# EAGLE design ESP_SIM7000V2.62 (EAGLE 9.6.2)

## Sheet 1 of 2
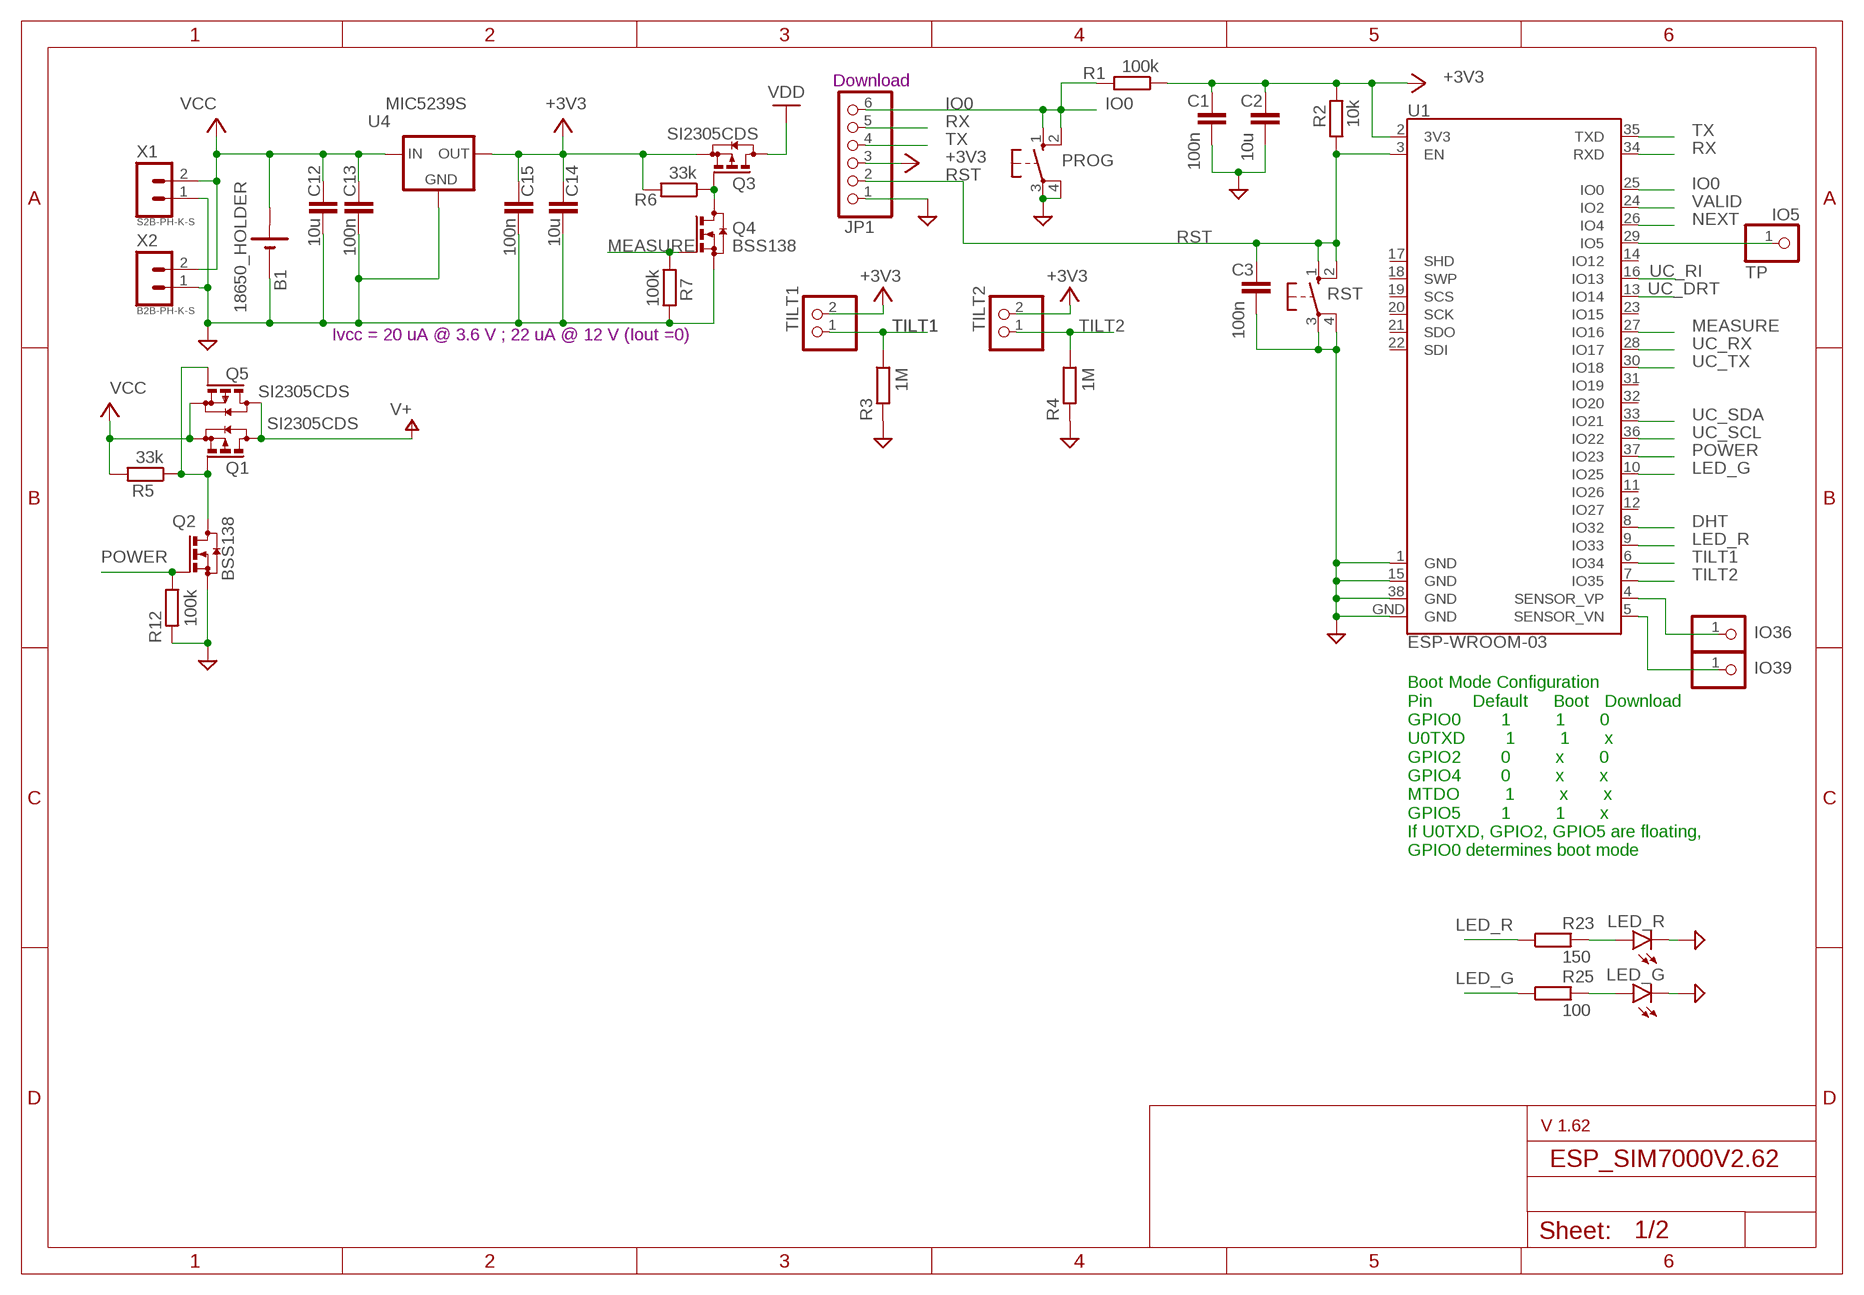
[diagram p0: schematic, sheet 1]

### Parts
B1  18650_HOLDER  [18650]
C1  100n  CC1206  [C1206]
C2  10u  CC1210  [C1210]
C3  100n  CC1206  [C1206]
C12  10u  CC1210  [C1210]
C13  100n  CC1206  [C1206]
C14  10u  CC1210  [C1210]
C15  100n  CC1206  [C1206]
IO5  TP  PINHD-1X1  [1X01]
IO36  PINHD-1X1  [1X01]
IO39  PINHD-1X1  [1X01]
JP1  PINHD-1X6  [1X06]
LED_G  LEDSMT1206  [1206]
LED_R  LEDSMT1206  [1206]
PROG  10-XX  [B3F-10XX]
Q1  SI2305CDS  [SOT23]
Q2  BSS138  BSS131  [SOT23]
Q3  SI2305CDS  [SOT23]
Q4  BSS138  BSS131  [SOT23]
Q5  SI2305CDS  [SOT23]
R1  100k  RR1206  [R1206]
R2  10k  RR1206  [R1206]
R3  1M  RR1206  [R1206]
R4  1M  RR1206  [R1206]
R5  33k  RR1206  [R1206]
R6  33k  RR1206  [R1206]
R7  100k  RR1206  [R1206]
R12  100k  RR1206  [R1206]
R23  150  RR1206  [R1206]
R25  100  RR1206  [R1206]
RST  10-XX  [B3F-10XX]
TILT1  PINHD-1X2  [1X02]
TILT2  PINHD-1X2  [1X02]
U1  ESP-WROOM-03  [ESP-WROOM-03]
U4  MIC5239S  [SOT223]
X1  S2B-PH-K-S  [S2B-PH-K-S]
X2  B2B-PH-K-S  [B2B-PH-K-S]

### Nets
+3V3: C1.1 C2.1 C14.1 C15.1 JP1.3 Q3.2(S) R1.1 R2.2 R6.2 TILT1.2 TILT2.2 U1.2(3V3) U4.3(OUT)
DHT: U1.8(IO32)
GND: B1.- C1.2 C2.2 C3.2 C12.2 C13.2 C14.2 C15.2 JP1.1 LED_G.C LED_R.C PROG.3(P) PROG.4(P1) Q2.2(S) Q4.2(S) R3.2 R4.2 R7.2 R12.2 RST.3(P) RST.4(P1) U1.1(GND) U1.15(GND) U1.38(GND) U1.GND U4.2(GND) U4.4(GND) X1.1 X2.1 ; also sheet 2
IO0: JP1.6 PROG.1(S) PROG.2(S1) R1.2 U1.25(IO0)
IO36: IO36.1 U1.4(SENSOR_VP)
IO39: IO39.1 U1.5(SENSOR_VN)
LED_G: R25.1 U1.10(IO25)
LED_R: R23.1 U1.9(IO33) ; also sheet 2
MEASURE: Q4.1(G) R7.1 U1.27(IO16)
N$1: Q1.1(G) Q2.3(D) Q5.1(G) R5.1
N$2: Q3.1(G) Q4.3(D) R6.1
N$7: LED_R.A R23.2
N$8: LED_G.A R25.2
N$17: IO5.1 U1.29(IO5)
NEXT: U1.26(IO4)
POWER: Q2.1(G) R12.1 U1.37(IO23)
RST: C3.1 JP1.2 R2.1 RST.1(S) RST.2(S1) U1.3(EN)
RX: JP1.5 U1.34(RXD)
TILT1: R3.1 TILT1.1 U1.6(IO34)
TILT2: R4.1 TILT2.1 U1.7(IO35)
TX: JP1.4 U1.35(TXD)
UC_DRT: U1.13(IO14) ; also sheet 2
UC_RI: U1.16(IO13) ; also sheet 2
UC_RX: U1.28(IO17) ; also sheet 2
UC_SCL: U1.36(IO22) ; also sheet 2
UC_SDA: U1.33(IO21) ; also sheet 2
UC_TX: U1.30(IO18) ; also sheet 2
V+: Q1.3(D) Q5.3(D)
VALID: U1.24(IO2)
VCC: B1.+ C12.1 C13.1 Q1.2(S) Q5.2(S) R5.2 U4.1(IN) X1.2 X2.2
VDD: Q3.3(D)
Unconnected: U1.11(IO26) U1.12(IO27) U1.14(IO12) U1.17(SHD) U1.18(SWP) U1.19(SCS) U1.20(SCK) U1.21(SDO) U1.22(SDI) U1.23(IO15) U1.31(IO19) U1.32(IO20)

### Notes on the sheet
- Download
- Ivcc = 20 uA @ 3.6 V ; 22 uA @ 12 V (Iout =0)
- Boot Mode Configuration
  Pin        Default     Boot   Download
  GPIO0        1         1       0
  U0TXD        1         1       x
  GPIO2        0         x       0
  GPIO4        0         x       x
  MTDO         1         x       x
  GPIO5        1         1       x
  If U0TXD, GPIO2, GPIO5 are floating, 
  GPIO0 determines boot mode
- V 1.62

## Sheet 2 of 2
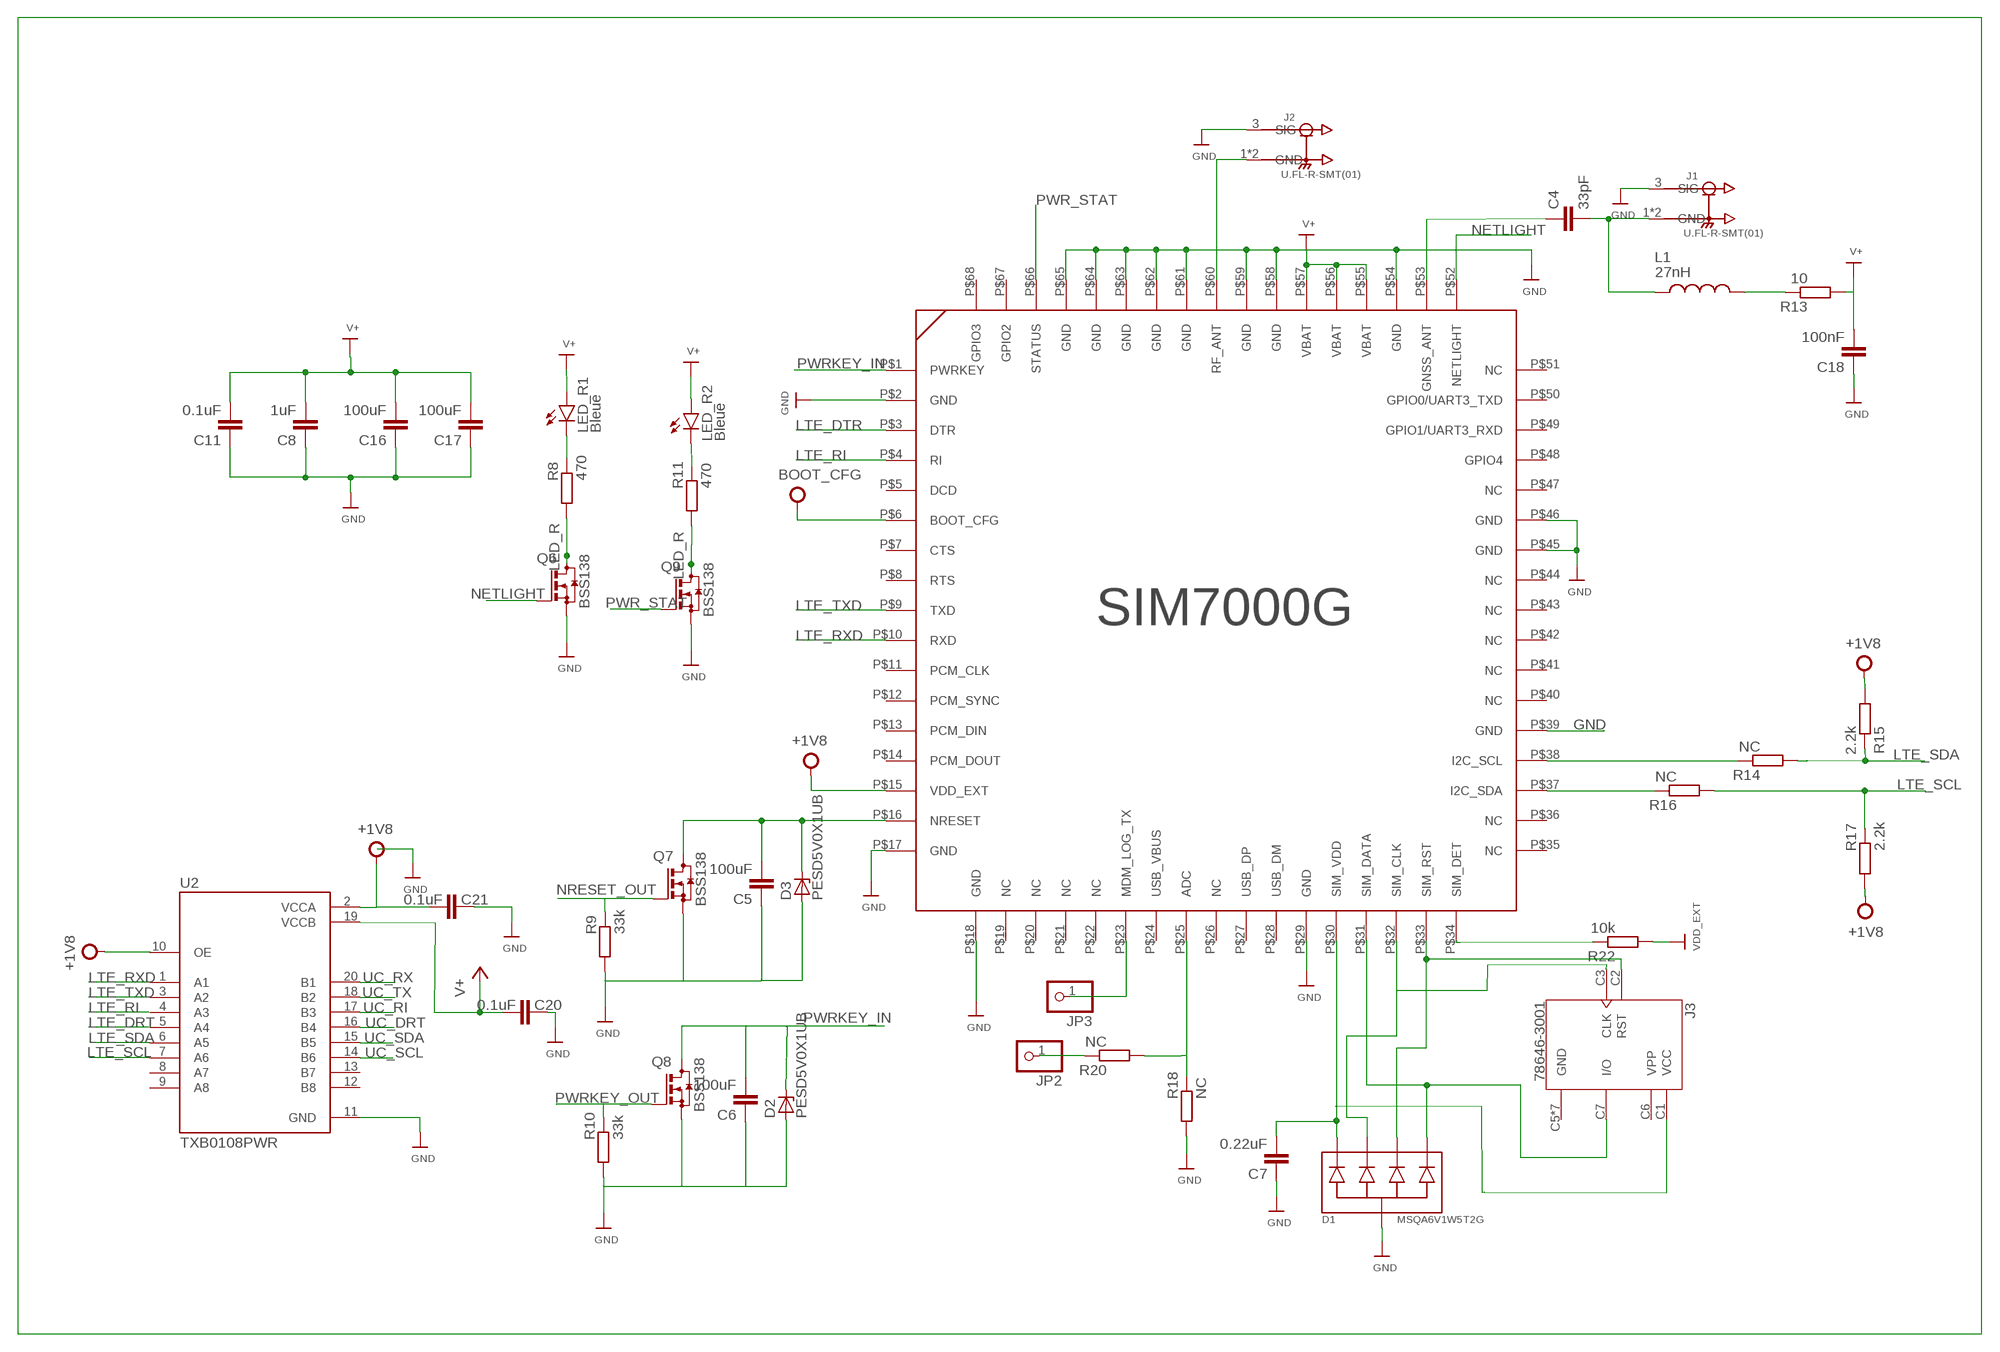
[diagram p1: schematic, sheet 2]

### Parts
C4  33pF  C-EUC0805  [C0805]
C5  100uF  C-EUC0805  [C0805]
C6  100uF  C-EUC0805  [C0805]
C7  0.22uF  C-EUC0805  [C0805]
C8  1uF  C-EUC0805  [C0805]
C11  0.1uF  C-EUC0805  [C0805]
C16  100uF  C-EUC0805  [C0805]
C17  100uF  C-EUC0805  [C0805]
C18  100nF  C-EUC0805  [C0805]
C20  0.1uF  CC1210  [C1210]
C21  0.1uF  CC1210  [C1210]
D1  MSQA6V1W5T2G  [SC88A]
D2  PESD5V0X1UB  [SOD523]
D3  PESD5V0X1UB  [SOD523]
J1  U.FL-R-SMT(01)  [HRS_U.FL-R-SMT(01)]
J2  U.FL-R-SMT(01)  [HRS_U.FL-R-SMT(01)]
J3  78646-3001  [MOLEX_78646-3001]
JP2  PINHD-1X1  [1X01]
JP3  PINHD-1X1  [1X01]
L1  27nH  LQM21PN1R0NGRD  [INDC2012X100N]
LED_R1  Bleue  LEDSMT1206  [1206]
LED_R2  Bleue  LEDSMT1206  [1206]
Q6  BSS138  BSS131  [SOT23]
Q7  BSS138  BSS131  [SOT23]
Q8  BSS138  BSS131  [SOT23]
Q9  BSS138  BSS131  [SOT23]
R8  470  RR1206  [R1206]
R9  33k  RR1206  [R1206]
R10  33k  RR1206  [R1206]
R11  470  RR1206  [R1206]
R13  10  RR1206  [R1206]
R14  NC  RR1206  [R1206]
R15  2.2k  RR1206  [R1206]
R16  NC  RR1206  [R1206]
R17  2.2k  RR1206  [R1206]
R18  NC  RR1206  [R1206]
R20  NC  RR1206  [R1206]
R22  10k  RR1206  [R1206]
U2  TXB0108PWR  [SOP65P640X120-20N]
U$1  SIM7000G  [SIM7000G]

### Nets
+1V8: C21.2 R15.1 R17.1 U2.2(VCCA) U2.10(OE) U$1.P$6(BOOT_CFG) U$1.P$15(VDD_EXT) ; supply symbol labelled BOOT_CFG
+5V: C20.2 U2.19(VCCB) ; supply symbol labelled V+
GND: C7.1 C8.1 C11.1 C16.1 C17.1 C18.1 C20.1 C21.1 D1.2 J1.3(SIG) J2.3(SIG) LED_R2.A Q6.2(S) Q9.2(S) R18.1 R22.1 U2.11(GND) U$1.P$2(GND) U$1.P$17(GND) U$1.P$18(GND) U$1.P$29(GND) U$1.P$39(GND) U$1.P$45(GND) U$1.P$46(GND) U$1.P$54(GND) U$1.P$55(VBAT) U$1.P$56(VBAT) U$1.P$57(VBAT) U$1.P$58(GND) U$1.P$59(GND) U$1.P$61(GND) U$1.P$62(GND) U$1.P$63(GND) U$1.P$64(GND) U$1.P$65(GND) ; supply symbol labelled V+, VDD_EXT ; also sheet 1
LED_R: Q6.3(D) Q9.3(D) R8.1 R11.1 ; also sheet 1
LTE_DTR: U$1.P$3(DTR)
LTE_RI: U$1.P$4(RI)
LTE_RXD: U$1.P$10(RXD)
LTE_SCL: R16.1 R17.2 U2.7(A6)
LTE_SDA: R14.1 R15.2 U2.6(A5)
LTE_TXD: U$1.P$9(TXD)
N$3: J2.1(GND) J2.2(GND) U$1.P$60(RF_ANT)
N$4: C4.2 J1.1(GND) J1.2(GND) L1.1
N$5: C4.1 U$1.P$53(GNSS_ANT)
N$6: C5.2 D3.1(K) Q7.3(D) U$1.P$16(NRESET)
N$9: D3.2(A)
N$10: LED_R1.C R8.2
N$11: J3.C1(VCC)
N$13: D1.5 J3.C7(I/O) U$1.P$31(SIM_DATA)
N$14: D1.4 J3.C2(RST) U$1.P$33(SIM_RST)
N$15: LED_R1.A
N$18: R10.2
N$19: C8.2 C11.2 C16.2 C17.2
N$20: C5.1
N$22: Q7.2(S) R9.1
N$23: R9.2
N$25: Q8.2(S) R10.1
N$27: C6.2
N$29: D2.2(A)
N$30: C6.1
N$31: D2.1(K)
N$33: LED_R2.C R11.2
N$34: R20.1
N$35: C18.2 R13.1
N$36: L1.2 R13.2
N$37: D1.3 U$1.P$32(SIM_CLK)
N$38: R14.2 U$1.P$38(I2C_SCL)
N$39: R16.2 U$1.P$37(I2C_SDA)
N$40: C7.2 D1.1 U$1.P$30(SIM_VDD)
N$41: J3.C3(CLK)
N$42: R18.2 U$1.P$25(ADC)
N$43: R22.2
N$44: U$1.P$34(SIM_DET)
N$45: JP3.1 U$1.P$23(MDM_LOG_TX)
NETLIGHT: Q6.1(G) U$1.P$52(NETLIGHT)
NRESET_OUT: Q7.1(G)
PWR_STAT: Q9.1(G) U$1.P$66(STATUS)
PWRKEY_IN: Q8.3(D) U$1.P$1(PWRKEY)
PWRKEY_OUT: Q8.1(G)
UC_DRT: U2.16(B4) ; also sheet 1
UC_RI: U2.17(B3) ; also sheet 1
UC_RX: U2.20(B1) ; also sheet 1
UC_SCL: U2.14(B6) ; also sheet 1
UC_SDA: U2.15(B5) ; also sheet 1
UC_TX: U2.18(B2) ; also sheet 1
Unconnected: JP2.1 R20.2 U2.1(A1) U2.3(A2) U2.4(A3) U2.5(A4) U2.8(A7) U2.9(A8) U2.12(B8) U2.13(B7) U$1.P$5(DCD) U$1.P$7(CTS) U$1.P$8(RTS) U$1.P$11(PCM_CLK) U$1.P$12(PCM_SYNC) U$1.P$13(PCM_DIN) U$1.P$14(PCM_DOUT) U$1.P$19(NC) U$1.P$20(NC) U$1.P$21(NC) U$1.P$22(NC) U$1.P$24(USB_VBUS) U$1.P$26(NC) U$1.P$27(USB_DP) U$1.P$28(USB_DM) U$1.P$35(NC) U$1.P$36(NC) U$1.P$40(NC) U$1.P$41(NC) U$1.P$42(NC) U$1.P$43(NC) U$1.P$44(NC) U$1.P$47(NC) U$1.P$48(GPIO4) U$1.P$49(GPIO1/UART3_RXD) U$1.P$50(GPIO0/UART3_TXD) U$1.P$51(NC) U$1.P$67(GPIO2) U$1.P$68(GPIO3)

## Power pins joined to a net without a drawn wire
GND: J3.C5(GND) J3.G1(GND) J3.G2(GND) J3.G3(GND) J3.G4(GND) J3.G5(GND) J3.G6(GND)
VPP: J3.C6(VPP)

## Library data of the parts
B1 = battery_bms:18650_HOLDER: 18650 holder
C1-C3 C12-C15 C20 C21 = eagle-ltspice:C: CAPACITOR, European symbol; SPICEMODEL: NONE; SPICEPREFIX: C
C4-C8 C11 C16-C18 = rcl:C-EU: CAPACITOR, European symbol; SPICEPREFIX: C
D1 = MSQA6V1W5T2G:MSQA6V1W5T2G: ESD Protection Diode Array Check availability <https://pricing.snapeda.com/parts/MSQA6V1W5T2G/onsemi/view-part?ref=eda>; AVAILABILITY: In Stock; CHECK_PRICES: https://www.snapeda.com/parts/MSQA6V1W5T2G/Onsemi/view-part/?ref=eda; DESCRIPTION: Clamp Ipp Tvs Diode Surface Mount SC-88A (SC-70-5/SOT-353); MF: onsemi; MP: MSQA6V1W5T2G; PACKAGE: SC-88A-5 ON Semiconductor; PRICE: None; PURCHASE-URL: https://www.snapeda.com/api/url_track_click_mouser/?unipart_id=7122110&manufacturer=onsemi&part_name=MSQA6V1W5T2G&search_term=msqa6v1w5t2g; SNAPEDA_LINK: https://www.snapeda.com/parts/MSQA6V1W5T2G/Onsemi/view-part/?ref=snap
D2 D3 = PESD5V0X1UB:PESD5V0X1UB: Ultra low capacitance unidirectional ElectroStatic Discharge (ESD) protection diode in a SOD523 (SC-79) ultra small and flat lead Surface-Mounted Device (SMD) plastic package designed to protect one signal line from the damage caused by ESD and other transients. AAL Eindhoven MK Check availability <https://pricing.snapeda.com/parts/PESD5V0X1UB/Nexperia%20USA/view-part?ref=eda>; AVAILABILITY: In Stock; CHECK_PRICES: https://www.snapeda.com/parts/PESD5V0X1UB/Nexperia/view-part/?ref=eda; DESCRIPTION: 8V (Typ) Clamp 1.5A (8/20µs) Ipp Tvs Diode Surface Mount SOD-523; MF: Nexperia USA; MP: PESD5V0X1UB; PACKAGE: SOD-523 NXP Semiconductors; PRICE: None; SNAPEDA_LINK: https://www.snapeda.com/parts/PESD5V0X1UB/Nexperia/view-part/?ref=snap
IO5 IO36 IO39 JP2 JP3 = pinhead:PINHD-1X1: PIN HEADER
J1 J2 = U.FL-R-SMT_01_:U.FL-R-SMT(01): U.FL Series 6 Ghz 50 Ohm Ultra-small SMT Coaxial Cable Receptacle Check availability <https://pricing.snapeda.com/parts/U.FL-R-SMT%2801%29/Hirose/view-part?ref=eda>; AVAILABILITY: In Stock; CHECK_PRICES: https://www.snapeda.com/parts/U.FL-R-SMT(01)/Hirose+Electric+Co+Ltd/view-part/?ref=eda; DESCRIPTION: U.FL (UMCC) Connector Receptacle, Male Pin 50Ohm Surface Mount Solder. RF Connectors / Coaxial Connectors; MF: Hirose; MP: U.FL-R-SMT(01); PACKAGE: None; PRICE: None; PURCHASE-URL: https://www.snapeda.com/api/url_track_click_mouser/?unipart_id=49572&manufacturer=Hirose&part_name=U.FL-R-SMT(01)&search_term=None; SNAPEDA_LINK: https://www.snapeda.com/parts/U.FL-R-SMT(01)/Hirose+Electric+Co+Ltd/view-part/?ref=snap
J3 = SIM:78646-3001: Conn Micro SIM Card SKT 6 POS 2.54mm Solder RA SMD 0.5A/Contact Embossed T/R Check availability <https://pricing.snapeda.com/parts/78646-3001/Molex/view-part?ref=eda>; AVAILABILITY: In Stock; CHECK_PRICES: https://www.snapeda.com/parts/78646-3001/Molex/view-part/?ref=eda; DESCRIPTION: Horizontal Surface Mount Micro SIM Card Connector, with Push In Termination | Molex Incorporated 78646-3001; MF: Molex; MP: 78646-3001; PACKAGE: None; PRICE: None; PURCHASE-URL: https://www.snapeda.com/api/url_track_click_mouser/?unipart_id=75189&manufacturer=Molex&part_name=78646-3001&search_term=micro sim; SNAPEDA_LINK: https://www.snapeda.com/parts/78646-3001/Molex/view-part/?ref=snap
JP1 = pinhead:PINHD-1X6: PIN HEADER
L1 = LQM21PN1R0NGRD:LQM21PN1R0NGRD: LQM21PN 1uH 950mA 30% MLT; CHECK_PRICES: https://www.snapeda.com/parts/LQM21PN1R0NGRD/Murata+Electronics+North+America/view-part/?ref=eda; DESCRIPTION: Inductor with Inductance: 1uH Tol. +/-30%, Package: 0805 (2012); MF: Murata; MP: LQM21PN1R0NGRD; PACKAGE: 2012 Murata; PURCHASE-URL: https://www.snapeda.com/api/url_track_click_mouser/?unipart_id=1499484&manufacturer=Murata&part_name=LQM21PN1R0NGRD&search_term=inductance 0805; RS_COMPONENTS_1674235_PURCHASE_URL: https://www.snapeda.com/api/url_track_click/https%253A//uk.rs-online.com/web/p/surface-mount-inductors/1674235//%253Futm_campaign%253Dbuynow%2526utm_medium%253Daggregator%2526utm_source%253Dsnapeda%2526cm_mmc%253Daff-_-uk-_-snapeda-_-1674235/?unipart_id=1499484&manufacturer=Murata&part_name=LQM21PN1R0NGRD&search_term=inductance 0805; RS_COMPONENTS_7867096P_PURCHASE_URL: https://www.snapeda.com/api/url_track_click/https%253A//uk.rs-online.com/web/p/surface-mount-inductors/7867096p//%253Futm_campaign%253Dbuynow%2526utm_medium%253Daggregator%2526utm_source%253Dsnapeda%2526cm_mmc%253Daff-_-uk-_-snapeda-_-7867096P/?unipart_id=1499484&manufacturer=Murata&part_name=LQM21PN1R0NGRD&search_term=inductance 0805; RS_COMPONENTS_7867096_PURCHASE_URL: https://www.snapeda.com/api/url_track_click/https%253A//uk.rs-online.com/web/p/surface-mount-inductors/7867096//%253Futm_campaign%253Dbuynow%2526utm_medium%253Daggregator%2526utm_source%253Dsnapeda%2526cm_mmc%253Daff-_-uk-_-snapeda-_-7867096/?unipart_id=1499484&manufacturer=Murata&part_name=LQM21PN1R0NGRD&search_term=inductance 0805; SNAPEDA_LINK: https://www.snapeda.com/parts/LQM21PN1R0NGRD/Murata+Electronics+North+America/view-part/?ref=snap
LED_G LED_R LED_R1 LED_R2 = led:LED: LED OSRAM: - CHIPLED LG R971, LG N971, LY N971, LG Q971, LY Q971, LO R971, LY R971 LH N974, LH R974 LS Q976, LO Q976, LY Q976 LO Q996 - Hyper CHIPLED LW Q18S LB Q993, LB Q99A, LB R99A - SideLED LS A670, LO A670, LY A670, LG A670, LP A670 LB A673, LV A673, LT A673, LW A673 LH A674 LY A675 LS A676, LA A676, LO A676, LY A676, LW A676 LS A679, LY A679, LG A679 - Hyper Micro SIDELED® LS Y876, LA Y876, LO Y876, LY Y876 LT Y87S - SmartLED LW L88C, LW L88S LB L89C, LB L89S, LG L890 LS L89K, LO L89K, LY L89K LS L896, LA L896, LO L896, LY L896 - TOPLED LS T670, LO T670, LY T670, LG T670, LP T670 LSG T670, LSP T670, LSY T670, LOP T670, LYG T670 LG T671, LOG T671, LSG T671 LB T673, LV T673, LT T673, LW T673 LH T674 LS T676, LA T676, LO T676, LY T676, LB T676, LH T676, LSB T676, LW T676 LB T67C, LV T67C, LT T67C, LS T67K, LO T67K, LY T67K, LW E67C LS E67B, LA E67B, LO E67B, LY E67B, LB E67C, LV E67C, LT E67C LW T67C LS T679, LY T679, LG T679 LS T770, LO T770, LY T770, LG T770, LP T770 LB T773, LV T773, LT T773, LW T773 LH T774 LS E675, LA E675, LY E675, LS T675 LS T776, LA T776, LO T776, LY T776, LB T776 LHGB T686 LT T68C, LB T68C - Hyper Mini TOPLED® LB M676 - Mini TOPLED Santana® LG M470 LS M47K, LO M47K, LY M47K Source: http://www.osram.convergy.de LUXEON: - LUMILED® LXK2-PW12-R00, LXK2-PW12-S00, LXK2-PW14-U00, LXK2-PW14-V00 LXK2-PM12-R00, LXK2-PM12-S00, LXK2-PM14-U00 LXK2-PE12-Q00, LXK2-PE12-R00, LXK2-PE12-S00, LXK2-PE14-T00, LXK2-PE14-U00 LXK2-PB12-K00, LXK2-PB12-L00, LXK2-PB12-M00, LXK2-PB14-N00, LXK2-PB14-P00, LXK2-PB14-Q00 LXK2-PR12-L00, LXK2-PR12-M00, LXK2-PR14-Q00, LXK2-PR14-R00 LXK2-PD12-Q00, LXK2-PD12-R00, LXK2-PD12-S00 LXK2-PH12-R00, LXK2-PH12-S00 LXK2-PL12-P00, LXK2-PL12-Q00, LXK2-PL12-R00 Source: www.luxeon.com KINGBRIGHT: KA-3528ASYC Source: www.kingbright.com
PROG RST = switch-omron:10-XX: OMRON SWITCH; MPN: B3F-1000; OC_FARNELL: 176432; OC_NEWARK: 36M3542
Q1 Q3 Q5 = transistor-small-signal-perso:SI2305CDS: P-CHANNEL MOS FET
Q2 Q4 Q6-Q9 = transistor-small-signal-perso:BSS131: N-CHANNEL MOS FET
R1-R18 R20 R22 R23 R25 = eagle-ltspice:R: RESISTOR, European symbol; SPICEMODEL: NONE; SPICEPREFIX: R
TILT1 TILT2 = pinhead:PINHD-1X2: PIN HEADER
U1 = esp32-sparkfun (1):ESP-WROOM-03; OC_FARNELL: unknown
U2 = TXB0108PWR:TXB0108PWR: 8-Bit Bidirectional Voltage-Level Shifter with Auto Direction Sensing and +/-15-kV ESD Protect 20-TSSOP -40 to 85 Check availability <https://pricing.snapeda.com/parts/TXB0108PWR/Texas%20Instruments/view-part?ref=eda>; CHECK_PRICES: https://www.snapeda.com/parts/TXB0108PWR/Texas+Instruments/view-part/?ref=eda; DESCRIPTION: 8-Bit Bidirectional Voltage-Level Shifter with Auto Direction Sensing and +/-15-kV ESD Protect; MF: Texas Instruments; MP: TXB0108PWR; PACKAGE: TSSOP-20 Texas Instruments; PURCHASE-URL: https://www.snapeda.com/api/url_track_click_mouser/?unipart_id=45111&manufacturer=Texas Instruments&part_name=TXB0108PWR&search_term=txb0108; RS_COMPONENTS_7099038P_PURCHASE_URL: https://www.snapeda.com/api/url_track_click/https%253A//uk.rs-online.com/web/p/translator-ics/7099038p//%253Futm_campaign%253Dbuynow%2526utm_medium%253Daggregator%2526utm_source%253Dsnapeda%2526cm_mmc%253Daff-_-uk-_-snapeda-_-7099038P/?unipart_id=45111&manufacturer=Texas Instruments&part_name=TXB0108PWR&search_term=txb0108; RS_COMPONENTS_7099038_PURCHASE_URL: https://www.snapeda.com/api/url_track_click/https%253A//uk.rs-online.com/web/p/translator-ics/7099038//%253Futm_campaign%253Dbuynow%2526utm_medium%253Daggregator%2526utm_source%253Dsnapeda%2526cm_mmc%253Daff-_-uk-_-snapeda-_-7099038/?unipart_id=45111&manufacturer=Texas Instruments&part_name=TXB0108PWR&search_term=txb0108; RS_COMPONENTS_9215119_PURCHASE_URL: https://www.snapeda.com/api/url_track_click/https%253A//uk.rs-online.com/web/p/translator-ics/9215119//%253Futm_campaign%253Dbuynow%2526utm_medium%253Daggregator%2526utm_source%253Dsnapeda%2526cm_mmc%253Daff-_-uk-_-snapeda-_-9215119/?unipart_id=45111&manufacturer=Texas Instruments&part_name=TXB0108PWR&search_term=txb0108; SNAPEDA_LINK: https://www.snapeda.com/parts/TXB0108PWR/Texas+Instruments/view-part/?ref=snap
U4 = micrel:MIC5239S: LDO REGULATOR
U$1 = SIM7000G:SIM7000G; CHECK_PRICES: https://www.snapeda.com/parts/SIM7000G/SIMCom/view-part/?ref=eda; DESCRIPTION: 802.15.4 Cat-M, Cat-NB, EDGE, GPRS, LPWA Transceiver Module 850MHz, 900MHz, 1.8GHz, 1.9GHz Antenna Not Included Surface Mount; MF: SIMCom Wireless Solutions Limited; MP: SIM7000G; PACKAGE: None; PURCHASE-URL: https://www.snapeda.com/api/url_track_click_mouser/?unipart_id=12130268&manufacturer=SIMCom Wireless Solutions Limited&part_name=SIM7000G&search_term=sim7000g; SNAPEDA_LINK: https://www.snapeda.com/parts/SIM7000G/SIMCom/view-part/?ref=snap
X1 = con-JST PH:S2B-PH: JST PH series header 2.00mm pitch disconnectable crimp style connectors, horizontal (side entry type), 2 pins
X2 = con-JST PH:B2B-PH: JST PH series header 2.00mm pitch disconnectable crimp style connectors, vertical (side entry type), 2 pins

## Board
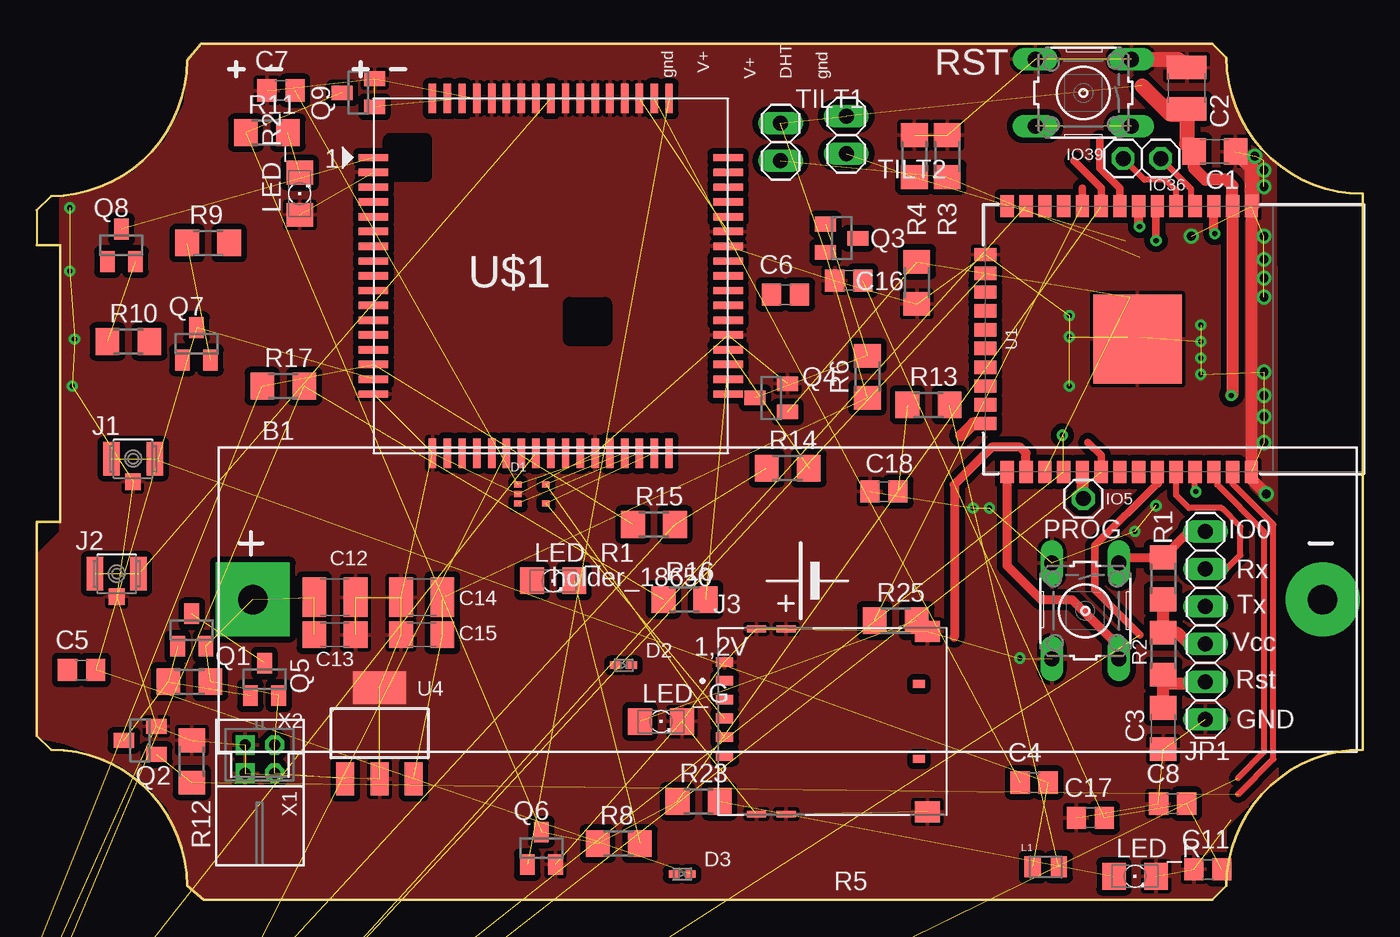
[diagram p2: board, top side]
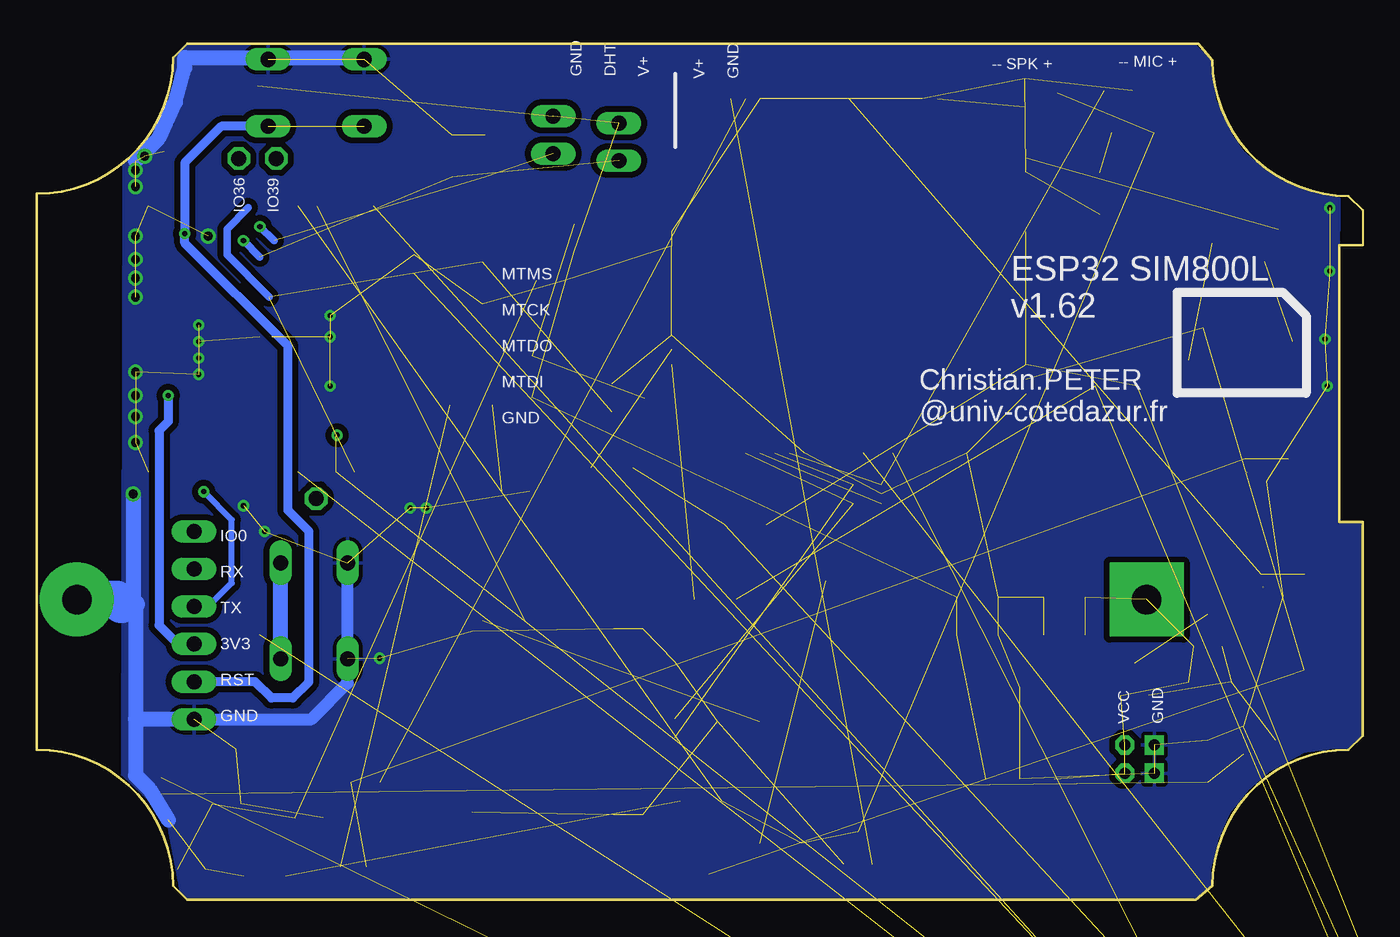
[diagram p3: board, bottom side, seen from below]

Size 89.69 x 57.94 mm. Coordinates in mm from the lower left corner, seen from the top.
Outline: 0.95,10.16 arc-90 10.16,0.95
Outline: 10.16,0.95 11.27,0 79.53,0 80.49,0.95 arc-90 89.69,10.16 89.69,47.78 arc-90 80.49,56.99 79.53,57.94 11.11,57.94 10.16,56.83 arc-90 0.95,47.62 0,46.67 0,44.29 1.59,44.29 1.59,25.56 0,25.56 0,11.11 0.95,10.16
Outline: 0.95,10.16 arc-90 10.16,0.95
Copper layers (1*16): Top 0.035mm / dielectric 1.5mm / Bottom 0.035mm
Design rules "default *": minimum track width 6mil, minimum drill 0.35mm, track to track 6mil, track to pad 6mil, pad to pad 6mil, via to via 6mil, smd to smd 6mil, copper to edge 0mil, drill to drill 6mil, minimum pad ring 10mil, minimum via ring 8mil, stop-mask expansion 4mil, vias tented up to drill 0mil, thermal gap 10mil

### Footprints (pad centres in the part's own frame; a part is rotated, then mirrored left to right if it is on the bottom)
18650 = drill 2 pad 5 square: + -36.2,0 | drill 2 pad 5: - 36.2,0
C1206 = smd 1.6 x 1.8: 1 -1.4,0; 2 1.4,0
C1210 = smd 1.6 x 2.7: 1 -1.4,0; 2 1.4,0
C0805 = smd 1.3 x 1.5: 1 -0.95,0; 2 0.95,0
SC88A = smd 0.5 x 0.4: 1 0,0.65; 2 0,0; 3 0,-0.65; 4 1.9,-0.65; 5 1.9,0.65
SOD523 = smd 0.7 x 0.5: 1 0.55,0; 2 -0.55,0
1X01 = drill 1.016 octagon: 1 0,0
HRS_U.FL-R-SMT(01) = smd 1.1 x 2.25: 1 -1.475,0; 2 1.475,0 | smd 1.05 x 1.1: 3 0,-1.55
MOLEX_78646-3001 = smd 1.15 x 0.65: C1 -7.295,2.755; C2 -7.295,0.215; C3 -7.295,-2.325; C5 -7.295,4.025; C6 -7.295,1.485; C7 -7.295,-1.055 | smd 1.3 x 0.45: G1 -5.125,6.27; G2 -3.125,6.27; G3 -5.125,-6.27; G4 -3.125,-6.27 | smd 1.7 x 1.4: G5 6.435,-6.105; G6 6.435,6.105 | smd 0.8 x 0.54: X1 5.855,2.54; X2 5.855,-2.54
1X06 = drill 1.016 long: 1 -6.35,0; 2 -3.81,0; 3 -1.27,0; 4 1.27,0; 5 3.81,0; 6 6.35,0
INDC2012X100N = smd 1.1 x 1.42: 1 -0.885,0; 2 0.885,0
1206 = smd 1.6 x 1.803: A -1.422,0; C 1.422,0
B3F-10XX = drill 1.016 long: 1 -3.251,2.261; 2 3.251,2.261; 3 -3.251,-2.261; 4 3.251,-2.261
SOT23 = smd 1 x 1.4: 1 -0.95,-1.1; 2 0.95,-1.1; 3 0,1.1
R1206 = smd 1.6 x 1.803: 1 -1.422,0; 2 1.422,0
1X02 = drill 1.016 long: 1 -1.27,0; 2 1.27,0
ESP-WROOM-03 = smd 0.9 x 1.5: 1 7.7,9; 2 6.43,9; 3 5.16,9; 4 3.89,9; 5 2.62,9; 6 1.35,9; 7 0.08,9; 8 -1.19,9; 9 -2.46,9; 10 -3.73,9; 11 -5,9; 12 -6.27,9; 13 -7.54,9; 14 -8.81,9; 25 -8.81,-9; 26 -7.54,-9; 27 -6.27,-9; 28 -5,-9; 29 -3.73,-9; 30 -2.46,-9; 31 -1.19,-9; 32 0.08,-9; 33 1.35,-9; 34 2.62,-9; 35 3.89,-9; 36 5.16,-9; 37 6.43,-9; 38 7.7,-9 | smd 1.5 x 0.9: 15 -10.3,5.715; 16 -10.3,4.445; 17 -10.3,3.175; 18 -10.3,1.905; 19 -10.3,0.635; 20 -10.3,-0.635; 21 -10.3,-1.905; 22 -10.3,-3.175; 23 -10.3,-4.445; 24 -10.3,-5.715 | smd 6 x 6: GND 0,0
SOP65P640X120-20N = smd 1.57 x 0.41: 1 -2.87,2.925; 2 -2.87,2.275; 3 -2.87,1.625; 4 -2.87,0.975; 5 -2.87,0.325; 6 -2.87,-0.325; 7 -2.87,-0.975; 8 -2.87,-1.625; 9 -2.87,-2.275; 10 -2.87,-2.925; 11 2.87,-2.925; 12 2.87,-2.275; 13 2.87,-1.625; 14 2.87,-0.975; 15 2.87,-0.325; 16 2.87,0.325; 17 2.87,0.975; 18 2.87,1.625; 19 2.87,2.275; 20 2.87,2.925
SOT223 = smd 1.219 x 2.235: 1 -2.311,-3.099; 2 0,-3.099; 3 2.311,-3.099 | smd 3.6 x 2.2: 4 0,3.099
SIM7000G = smd 2 x 0.5: P$1 -12,8; P$2 -12,7; P$3 -12,6; P$4 -12,5; P$5 -12,4; P$6 -12,3; P$7 -12,2; P$8 -12,1; P$9 -12,0; P$10 -12,-1; P$11 -12,-2; P$12 -12,-3; P$13 -12,-4; P$14 -12,-5; P$15 -12,-6; P$16 -12,-7; P$17 -12,-8; P$35 12,-8; P$36 12,-7; P$37 12,-6; P$38 12,-5; P$39 12,-4; P$40 12,-3; P$41 12,-2; P$42 12,-1; P$43 12,0; P$44 12,1; P$45 12,2; P$46 12,3; P$47 12,4; P$48 12,5; P$49 12,6; P$50 12,7; P$51 12,8 | smd 0.5 x 2: P$18 -8,-12; P$19 -7,-12; P$20 -6,-12; P$21 -5,-12; P$22 -4,-12; P$23 -3,-12; P$24 -2,-12; P$25 -1,-12; P$26 0,-12; P$27 1,-12; P$28 2,-12; P$29 3,-12; P$30 4,-12; P$31 5,-12; P$32 6,-12; P$33 7,-12; P$34 8,-12; P$52 8,12; P$53 7,12; P$54 6,12; P$55 5,12; P$56 4,12; P$57 3,12; P$58 2,12; P$59 1,12; P$60 0,12; P$61 -1,12; P$62 -2,12; P$63 -3,12; P$64 -4,12; P$65 -5,12; P$66 -6,12; P$67 -7,12; P$68 -8,12
S2B-PH-K-S = drill 0.75 pad 1.3 square: 1 1,0 | drill 0.75 pad 1.3 octagon: 2 -1,0
B2B-PH-K-S = drill 0.75 pad 1.3 square: 1 1,0 | drill 0.75 pad 1.3 octagon: 2 -1,0

### Placement (x,y rotation side)
B1  50.8,20.32 0 top
C1  79.69,50.64 0 top
C2  77.79,54.93 90 top
C3  76.2,11.59 270 top
C4  67.47,7.94 0 top
C5  3.02,15.56 0 top
C6  50.64,40.96 0 top
C7  16.51,54.77 0 top
C8  76.84,6.51 0 top
C11  79.22,2.06 0 top
C12  20.16,20.48 0 top
C13  20.16,17.94 0 top
C14  26.04,20.48 180 top
C15  26.04,17.94 180 top
C16  54.93,41.91 0 top
C17  71.28,5.56 0 top
C18  57.31,27.62 0 top
C20  -9.84,-85.41 0 top  (outside the outline)
C21  -9.84,-63.02 0 top  (outside the outline)
D1  32.54,27.46 0 top
D2  39.69,15.87 0 top
D3  43.66,1.75 0 top
IO5  70.8,27.15 0 top
IO36  76.04,50.16 0 top
IO39  73.5,50.16 90 top
J1  6.51,29.85 0 top
J2  5.4,22.07 0 top
J3  53.82,12.06 0 top
JP1  79.06,18.57 90 top
JP2  -2.22,-32.07 0 top  (outside the outline)
JP3  -2.22,-37.15 0 top  (outside the outline)
L1  68.26,2.22 0 top
LED_G  42.23,12.06 0 top
LED_R  74.3,1.59 0 top
LED_R1  34.93,21.59 0 top
LED_R2  17.78,47.78 90 top
PROG  70.93,19.56 270 top
Q1  10.48,18.26 0 top
Q2  6.98,10.79 90 top
Q3  54.45,44.77 270 top
Q4  49.69,33.97 90 top
Q5  15.4,14.92 0 top
Q6  34.13,3.49 0 top
Q7  10.79,37.62 0 top
Q8  5.71,44.29 0 top
Q9  21.75,54.61 90 top
R1  76.2,21.75 90 top
R2  76.2,16.67 90 top
R3  61.59,50.32 90 top
R4  59.37,50.32 90 top
R5  10.32,14.76 0 top
R6  56.2,35.4 270 top
R7  59.53,41.75 270 top
R8  39.37,3.81 0 top
R9  11.59,44.45 0 top
R10  6.19,37.78 0 top
R11  15.56,51.91 0 top
R12  10.48,9.37 90 top
R13  60.33,33.5 0 top
R14  50.8,29.21 0 top
R15  41.75,25.4 0 top
R16  43.81,20.32 0 top
R17  16.67,34.77 0 top
R18  -1.59,-12.86 0 top  (outside the outline)
R20  -1.59,-19.05 0 top  (outside the outline)
R22  -1.59,-25.24 0 top  (outside the outline)
R23  44.77,6.67 0 top
R25  58.1,18.89 0 top
RST  70.8,54.61 180 top
TILT1  50.32,51.28 90 top
TILT2  54.77,51.75 90 top
U1  74.46,37.95 0 top
U2  -8.1,-33.02 0 top  (outside the outline)
U4  23.18,11.27 0 top
U$1  34.77,42.23 0 top
X1  15.08,8.57 180 top
X2  15.08,10.48 180 top

### Tracks (layer width: path | path; a pad name or v marks a point on that pad's centre or on a via)
+1V8  (6 unrouted)
+3V3  (via drill 0.35)  (7 unrouted)
  Top 0.813: JP1.3 77.95,17.3 77.16,18.09 R2.2 R1.1 | C1.1 78.29,49.5 79.06,48.74 80.49,48.74 80.89,48.33 U1.2 80.89,34.22 v80.8,34.13
  Top 1.016: 74.77,55.09 76.68,53.18 77.44,53.18 C2.1 77.79,51.15 C1.1
  Bottom 0.61: JP1.3 80.17,17.3 81.44,18.57 81.44,31.75 80.8,32.38 v80.8,34.13
+5V  (1 unrouted)
DHT
  Top 0.508: U1.8 73.27,48.17 71.91,49.53 71.91,51.44
GND  (via drill 0.35, 0.6)  (91 unrouted)
  Top 0.61: U1.GND 74.62,38.1
  Top 0.813: v83.19,27.46 82.16,28.49 U1.38 U1.1 82.21,46.99 82.23,46.99
  Top 1.016: 73.82,38.1 74.31,38.1 U1.GND | 82.23,46.99 82.23,49.5 C1.2 | RST.3 77.24,56.87 C2.2
  Bottom 0.813: RST.3 74.17,56.99 | JP1.1 71.12,12.22 68.67,14.67 PROG.4 PROG.3
  Bottom 1.016: v83.19,27.46 83.19,20 | 83.03,20 83.03,12.22 | 83.03,12.22 83.03,8.41 82.07,7.46 80.8,5.4 | 83.03,50.01 81.44,51.59 80.33,53.97 79.69,56.3 79.69,56.99 67.67,56.99 RST.4 67.43,56.99 | JP1.1 83.03,12.22
  Bottom 1.27: 83.98,20 83.19,20 83.03,20
  Bottom 2.54: B1.- 84.3,20.32 83.98,20
  other vias: 83.03,43.34 83.03,35.72 83.03,42.07 83.03,30.96 83.03,44.93 83.03,40.8 83.03,34.13 83.03,32.7 2.38,34.77 2.54,37.94 2.22,42.55 69.85,39.53 69.85,38.1 69.85,34.77 2.22,46.83 64.45,26.51 63.34,26.51 66.52,16.35 83.03,48.26 78.11,44.93 82.39,50.32 83.03,49.37 74.3,24.92 75.72,26.67 78.74,38.89 78.74,37.78 78.74,36.67 78.74,35.56
  pour Top (isolate 0.406): 11.27,0 10.32,0.79 10.32,1.75 10,3.49 8.89,6.19 6.98,8.25 5.56,9.21 1.94,10.6 0.18,10.95 0.07,23.4 1.59,24.92 1.59,47.47 1.9,47.47 4.76,48.26 6.51,49.21 8.73,51.44 10,53.82 10.32,56.83 11.27,57.79 79.53,57.79 80.33,56.99 80.33,55.56 81.98,51.18 83.82,49.81 83.93,8.33 81.9,6.43 81.9,6.33 80.41,4.85 80.41,1.04 79.38,0
  pour Bottom (isolate 0.406): 11.27,0 10.32,0.95 10.32,2.06 9.84,4.13 9.05,5.87 7.78,7.46 6.35,8.73 3.97,10 1.75,10.32 0.95,10.32 0.16,11.11 0,25.4 1.75,25.4 1.59,47.47 3.65,47.94 5.4,48.58 6.83,49.53 8.1,50.64 8.89,51.75 10,54.13 10.32,56.83 11.27,57.79 79.53,57.79 80.33,56.99 80.33,52.41 83.82,49.81 83.93,8.45 81.21,5.89 81.21,5.32 80.79,4.91 79.98,0.61 79.38,0
IO0
  Top 0.61: 65.56,28.86 U1.25 65.65,22.61 67.95,20.32 70.01,20.32 73.19,17.14 PROG.2 | PROG.1 73.55,23.17 R1.2 77.95,24.92 JP1.6
  Bottom 1.016: PROG.2 PROG.1
IO36
  Top 0.406: U1.4 78.35,47.38 78.11,47.62 78.11,48.1 IO36.1
IO39
  Top 0.406: U1.5 77.08,48.01 76.36,48.74 74.93,48.74 IO39.1
LED_G  (1 unrouted)
  Top 0.508: 70.73,48.17 U1.10
LED_R  (5 unrouted)
  Top 0.508: U1.9 72,48.17 70.17,50.01
LTE_SCL  (2 unrouted)
LTE_SDA  (2 unrouted)
MEASURE  (3 unrouted)
  Bottom 0.508: 75.41,46.83 76.84,45.4 76.84,43.66 73.98,40.8
N$1  (3 unrouted)
N$2  (2 unrouted)
N$3  (2 unrouted)
N$4  (3 unrouted)
N$5  (1 unrouted)
N$6  (3 unrouted)
N$7  (1 unrouted)
N$8  (1 unrouted)
N$10  (1 unrouted)
N$13  (2 unrouted)
N$14  (2 unrouted)
N$17
  Top 0.813: U1.29 70.73,27.21 IO5.1
N$19  (3 unrouted)
N$22  (1 unrouted)
N$25  (1 unrouted)
N$33  (1 unrouted)
N$35  (1 unrouted)
N$36  (1 unrouted)
N$37  (1 unrouted)
N$38  (1 unrouted)
N$39  (1 unrouted)
N$40  (2 unrouted)
N$42  (1 unrouted)
N$45  (1 unrouted)
NETLIGHT  (1 unrouted)
NEXT
  Top 0.61: U1.26 66.92,30.23 66.52,30.64 64.61,30.64 62.07,28.1 62.07,17.78
POWER  (2 unrouted)
  Top 0.406: 81.28,7.14 83.66,9.53 83.66,25.4 80.89,28.17 U1.37
PWR_STAT  (1 unrouted)
PWRKEY_IN  (1 unrouted)
RST  (via drill 0.35)  (1 unrouted)
  Top 0.61: v79.69,45.08 79.62,45.15 U1.3
  Top 0.813: C3.1 76.2,14.6 | 76.2,14.6 R2.1 | JP1.2 78.9,14.6 76.2,14.6
  Bottom 0.61: JP1.2 74.93,14.76 73.82,13.65 72.39,13.65 71.28,14.76 71.28,24.92 72.71,26.35 72.71,37.47 79.69,44.45 v79.69,45.08 79.69,49.89 77.23,52.35 RST.1
RX
  Top 0.406: JP1.5 80.49,22.38 81.44,23.34 81.44,25.24 80.17,26.51 77.95,26.51 77.08,27.37 U1.34
TILT1  (via drill 0.35)  (2 unrouted)
  Top 0.508: v75.72,44.61 75.72,46.86 U1.6
  Bottom 0.508: 74.61,43.5 v75.72,44.61
TILT2  (via drill 0.35)  (2 unrouted)
  Top 0.61: v74.61,45.56 74.54,45.63 U1.7
  Bottom 0.508: 73.66,44.61 v74.61,45.56
TX  (via drill 0.35)
  Top 0.406: 78.35,27.69 U1.35
  Top 0.61: 78.35,27.69 v78.42,27.62
  Bottom 0.406: JP1.4 78.11,19.84 76.52,21.43 76.52,25.72 v78.42,27.62
UC_DRT  (1 unrouted)
UC_RI  (1 unrouted)
UC_RX  (via drill 0.35)  (2 unrouted)
  Top 0.508: 69.46,31.43 v69.37,31.43
UC_SCL  (1 unrouted)
  Top 0.406: 81.28,8.25 83.03,10 83.03,24.92 79.85,28.1 79.85,28.72 U1.36
UC_SDA  (1 unrouted)
  Top 0.508: 75.81,28.19 71.6,23.97 71.6,20.96 74.61,17.94
  Top 0.61: 75.81,28.63 75.97,28.79 U1.33 75.81,28.19
UC_TX  (1 unrouted)
  Top 0.508: U1.30 72,30.07 71.12,30.96
V+  (1 unrouted)
VALID
  Top 0.61: 64.01,32.38 U1.24
  Top 0.813: U1.24 63.35,32.23 62.54,31.43
VCC  (8 unrouted)

### Text on the board
tNames: gnd / / V+ | V+ / / DHT / / gnd | IO0 | Rx | Tx | Vcc | Rst | GND
bNames: -- MIC + | -- SPK + | V+ / / GND | GND / / DHT / / V+ | IO36 / / IO39 | ESP32 SIM800L / v1.62 | Christian.PETER / @univ-cotedazur.fr | MTMS / / MTCK / / MTDO / / MTDI / / GND | IO0 / / RX / / TX / / 3V3 / / RST / / GND | VCC / / GND